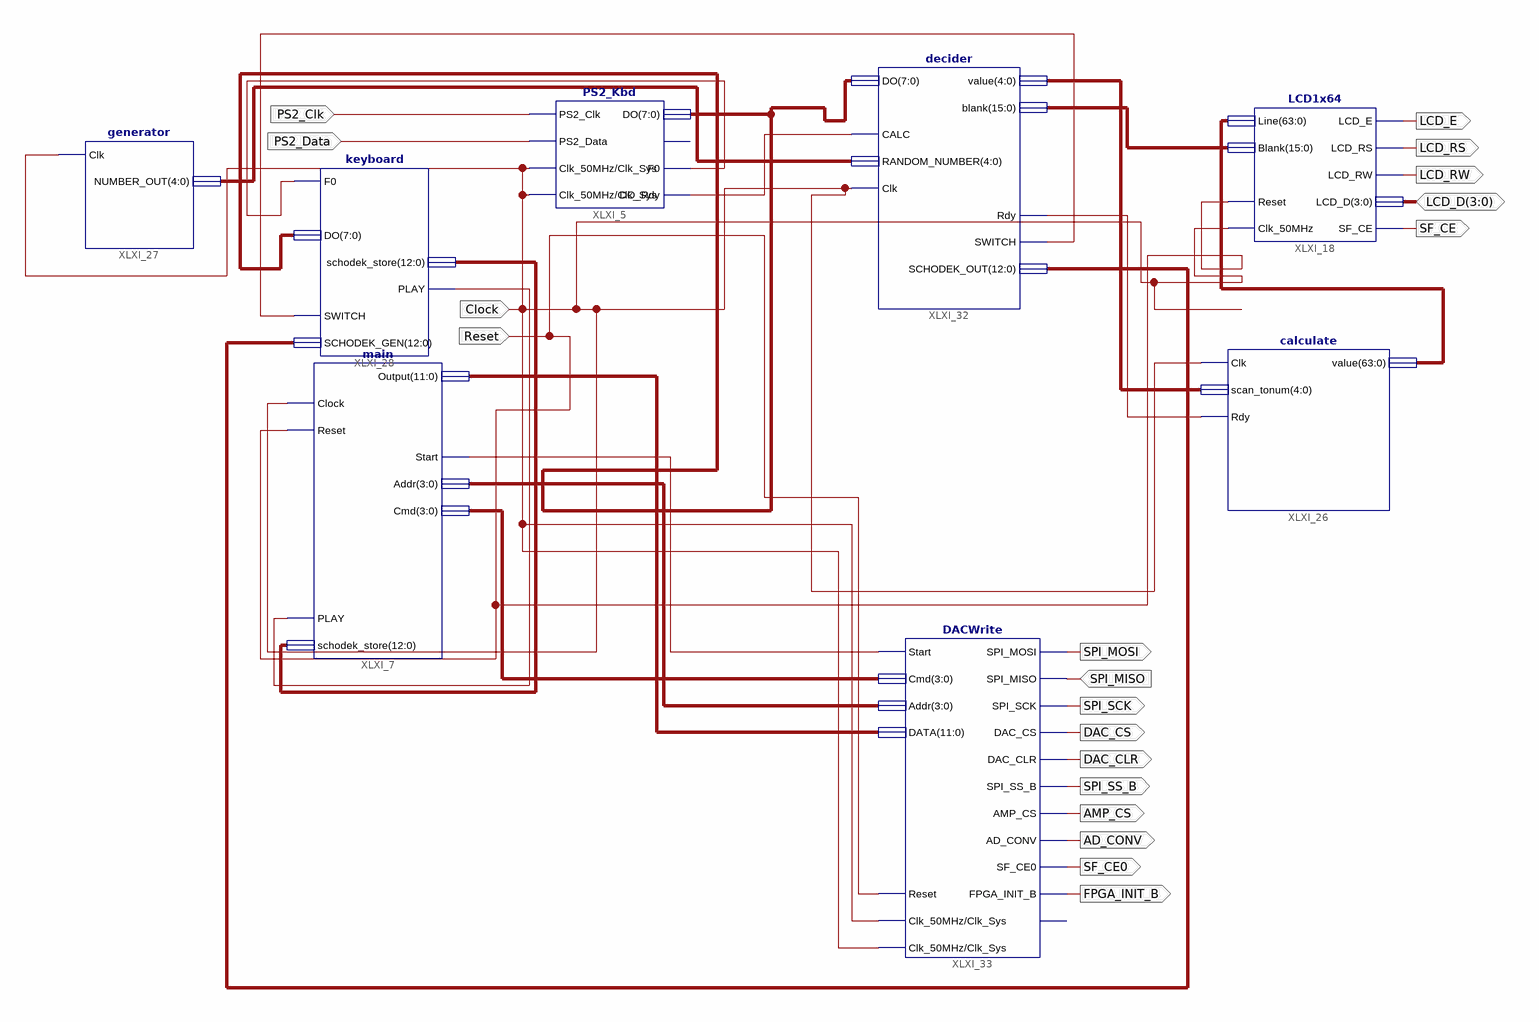
[diagram p0: schematic sheet 1]
// Xilinx ISE schematic main_sch.sch (spartan3e) as structural Verilog: 8 symbols, 19 ports
module main_sch (
  input  PS2_Clk,
  input  PS2_Data,
  input  Reset,
  input  Clock,
  input  SPI_MISO,
  inout  [3:0] LCD_D,
  output LCD_E,
  output LCD_RS,
  output LCD_RW,
  output SF_CE,
  output SPI_MOSI,
  output SPI_SCK,
  output DAC_CS,
  output DAC_CLR,
  output SPI_SS_B,
  output AMP_CS,
  output AD_CONV,
  output SF_CE0,
  output FPGA_INIT_B
);

  wire XLXN_92, XLXN_95, XLXN_103, XLXN_106, XLXN_123, XLXN_139;
  wire [3:0] XLXN_124, XLXN_125;
  wire [4:0] XLXN_90, XLXN_93;
  wire [7:0] XLXN_38;
  wire [11:0] XLXN_126;
  wire [12:0] XLXN_105, XLXN_138;
  wire [15:0] XLXN_86;
  wire [63:0] XLXN_94;

  PS2_Kbd XLXI_5 (
    .PS2_Clk(PS2_Clk), .PS2_Data(PS2_Data), .Clk_50MHz(Clock), .F0(XLXN_103), .DO_Rdy(XLXN_92), .DO(XLXN_38),
    .Clk_Sys(Clock));  // open: E0
  main XLXI_7 (
    .PLAY(XLXN_106), .Clock(Clock), .Reset(Reset), .schodek_store(XLXN_105), .Start(XLXN_123),
    .Output(XLXN_126), .Addr(XLXN_125), .Cmd(XLXN_124));
  LCD1x64 XLXI_18 (
    .Clk_50MHz(Clock), .Reset(Reset), .Line(XLXN_94), .Blank(XLXN_86), .LCD_D(LCD_D), .LCD_E(LCD_E),
    .LCD_RW(LCD_RW), .LCD_RS(LCD_RS), .SF_CE(SF_CE));
  calculate XLXI_26 (.Clk(Clock), .scan_tonum(XLXN_93), .value(XLXN_94), .Rdy(XLXN_95));
  generator XLXI_27 (.Clk(Clock), .NUMBER_OUT(XLXN_90));
  keyboard XLXI_28 (
    .F0(XLXN_103), .SWITCH(XLXN_139), .DO(XLXN_38), .SCHODEK_GEN(XLXN_138), .PLAY(XLXN_106),
    .schodek_store(XLXN_105));
  decider XLXI_32 (
    .Clk(Clock), .CALC(XLXN_92), .RANDOM_NUMBER(XLXN_90), .DO(XLXN_38), .SWITCH(XLXN_139), .Rdy(XLXN_95),
    .value(XLXN_93), .blank(XLXN_86), .SCHODEK_OUT(XLXN_138));
  DACWrite XLXI_33 (
    .Reset(Reset), .Start(XLXN_123), .SPI_MISO(SPI_MISO), .Cmd(XLXN_124), .Addr(XLXN_125), .DATA(XLXN_126),
    .DAC_CLR(DAC_CLR), .DAC_CS(DAC_CS), .SPI_MOSI(SPI_MOSI), .SPI_SCK(SPI_SCK), .SPI_SS_B(SPI_SS_B),
    .AMP_CS(AMP_CS), .AD_CONV(AD_CONV), .SF_CE0(SF_CE0), .FPGA_INIT_B(FPGA_INIT_B), .Clk_50MHz(Clock),
    .Clk_Sys(Clock));  // open: Busy
endmodule
